# EAGLE design unicorder-mk-2.1 (EAGLE 6.5.0)
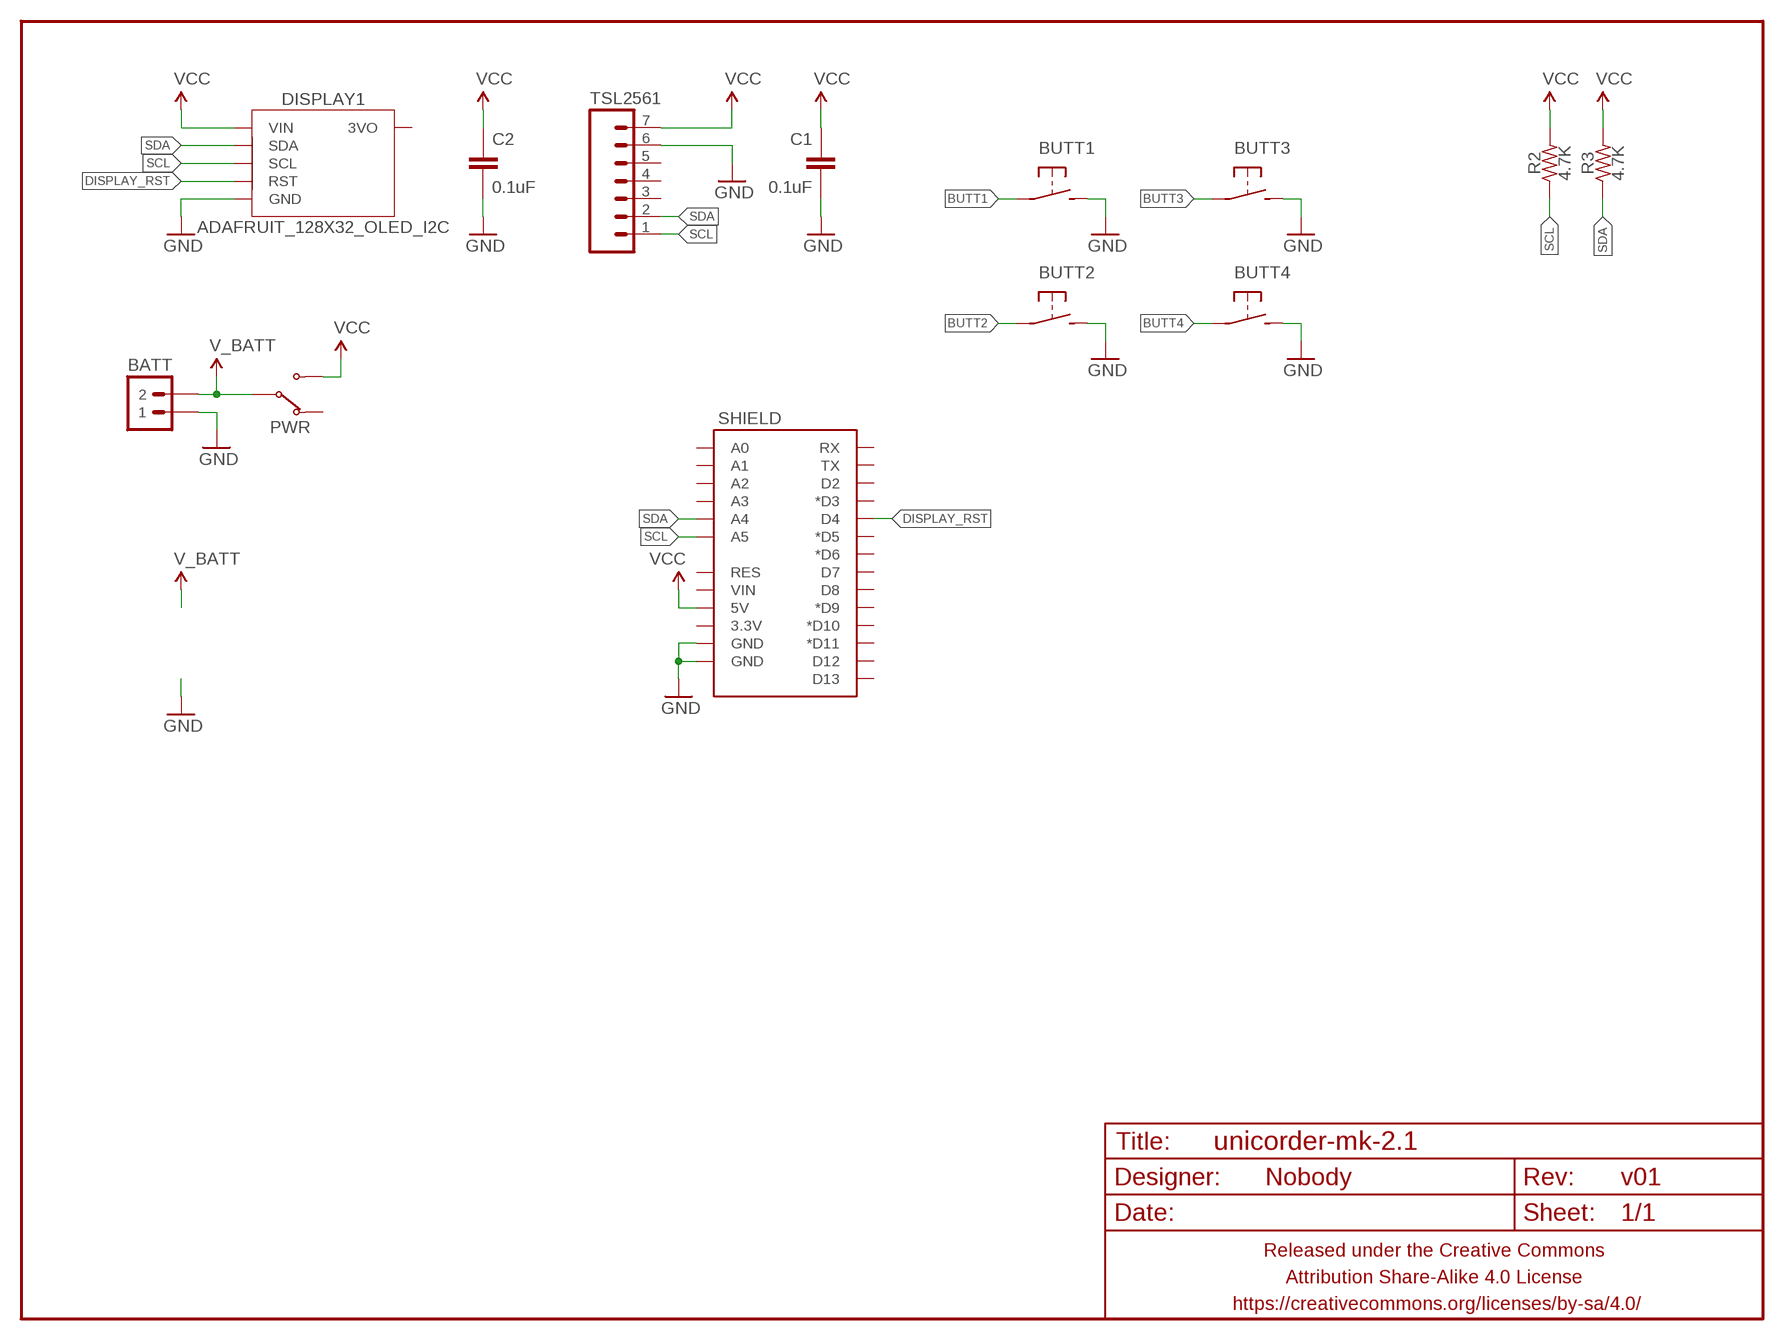
[diagram p0: schematic, sheet 1]

## Parts
BATT  M02JST-PTH-VERT  [JST-2-PH-VERT-PTH]
BUTT1  SPST-NO-TACT6MM-PTH-SMALL-PADS  [DTS-6-SMALL-PADS]
BUTT2  SPST-NO-TACT6MM-PTH-SMALL-PADS  [DTS-6-SMALL-PADS]
BUTT3  SPST-NO-TACT6MM-PTH-SMALL-PADS  [DTS-6-SMALL-PADS]
BUTT4  SPST-NO-TACT6MM-PTH-SMALL-PADS  [DTS-6-SMALL-PADS]
C1  0.1uF  CAPACITOR-CERAMIC025-024X044  [C025-024X044]
C2  0.1uF  CAPACITOR-CERAMIC025-024X044  [C025-024X044]
DISPLAY1  ADAFRUIT_128X32_OLED_I2C  ADAFRUIT_128X32_OLED_I2CCLOSER  [ADAFRUIT_128X32_OLED_I2C_CLOSER]
FRAME1  FRAME-LETTERNO_PACKAGE  [DUMMY]
PWR  SWITCH-SPDTPTH-VERT-2.54MM  [SWITCH-SPDT]
R2  4.7K  RESISTORPTH-AXIAL-6.35MM  [RESISTOR-AXIAL-PTH-6.35MM]
R3  4.7K  RESISTORPTH-AXIAL-6.35MM  [RESISTOR-AXIAL-PTH-6.35MM]
SHIELD  ARDUINO_SHIELD_SMALLER  [ARDUINO_SHIELD_NOOUTLINE_INSIDE_SMALLER]
TSL2561  M07PTH-SLIMASS  [1X07_PTH_SLIMASS]

## Nets
BUTT1: BUTT1.1 BUTT1.2
BUTT2: BUTT2.1 BUTT2.2
BUTT3: BUTT3.1 BUTT3.2
BUTT4: BUTT4.1 BUTT4.2
DISPLAY_RST: DISPLAY1.RST SHIELD.D4
GND: BATT.1 BUTT1.3 BUTT1.4 BUTT2.3 BUTT2.4 BUTT3.3 BUTT3.4 BUTT4.3 BUTT4.4 C1.2 C2.2 DISPLAY1.GND SHIELD.GND@0(GND) SHIELD.GND@1(GND) TSL2561.6
SCL: DISPLAY1.SCL R2.P$1 SHIELD.A5 TSL2561.1
SDA: DISPLAY1.SDA R3.P$1 SHIELD.A4 TSL2561.2
V_BATT: BATT.2 PWR.2(COM)
VCC: C1.1 C2.1 DISPLAY1.VIN PWR.3(NO) R2.P$2 R3.P$2 SHIELD.5V TSL2561.7
Unconnected: DISPLAY1.3VO PWR.1(NC) SHIELD.3.3V SHIELD.A0 SHIELD.A1 SHIELD.A2 SHIELD.A3 SHIELD.D2 SHIELD.D3(*D3) SHIELD.D5(*D5) SHIELD.D6(*D6) SHIELD.D7 SHIELD.D8 SHIELD.D9(*D9) SHIELD.D10(*D10) SHIELD.D11(*D11) SHIELD.D12 SHIELD.D13 SHIELD.RES SHIELD.RX SHIELD.TX SHIELD.VIN TSL2561.3 TSL2561.4 TSL2561.5

## Library data of the parts
BATT = A_butts:M02: Standard 2-pin 0.1" header. Use with - straight break away headers ( PRT-00116) - right angle break away headers (PRT-00553) - swiss pins (PRT-00743) - machine pins (PRT-00117) - female headers (PRT-00115) Molex polarized connector foot print use with: PRT-08233 with associated crimp pins and housings. 2.54_SCREWTERM for use with PRT-10571. 3.5mm Screw Terminal footprints for PRT-08084 5mm Screw Terminal footprints for use with PRT-08433
BUTT1-BUTT4 = A_butts:SPST-NO-TACT
C1 C2 = A_butts:CAPACITOR-CERAMIC: CAPACITOR, European symbol
DISPLAY1 = A_butts:ADAFRUIT_128X32_OLED_I2C
FRAME1 = A_butts:FRAME-LETTER: Schematic Frame Standard 8.5x11 US Letter frame; DESIGNER: Nobody; VERSION: v01
PWR = A_butts:SWITCH-SPDT
R2 R3 = A_butts:RESISTOR: RESISTOR, American symbol
SHIELD = A_butts:ARDUINO_SHIELD_SMALLER
TSL2561 = A_butts:M07: Header 7 Standard 7-pin 0.1" header. Use with straight break away headers (SKU : PRT-00116), right angle break away headers (PRT-00553), swiss pins (PRT-00743), machine pins (PRT-00117), and female headers (PRT-00115). NOTES ON THE VARIANTS LOCK and LOCK_LONGPADS... This footprint was designed to help hold the alignment of a through-hole component (i.e. 7-pin header) while soldering it into place. You may notice that each hole has been shifted either up or down by 0.005 of an inch from it's more standard position (which is usually a perfectly straight line). This slight alteration caused the pins (the squares in the middle) to touch the edges of the holes. Because they are alternating, it causes a "brace" to hold the header in place. 0.005 has proven to be the perfect amount of "off-center" position when using our standard breakaway headers. Although looks a little odd when you look at the bare footprint, once you have a header in there, the alteration is very hard to notice. Also, if you push a header all the way into place, it is covered up entirely on the bottom side. This idea of altering the position of holes to aid alignment will be further integrated into the Sparkfun Library for other footprints. It can help hold any component with 3 or more connection pins.

## Board
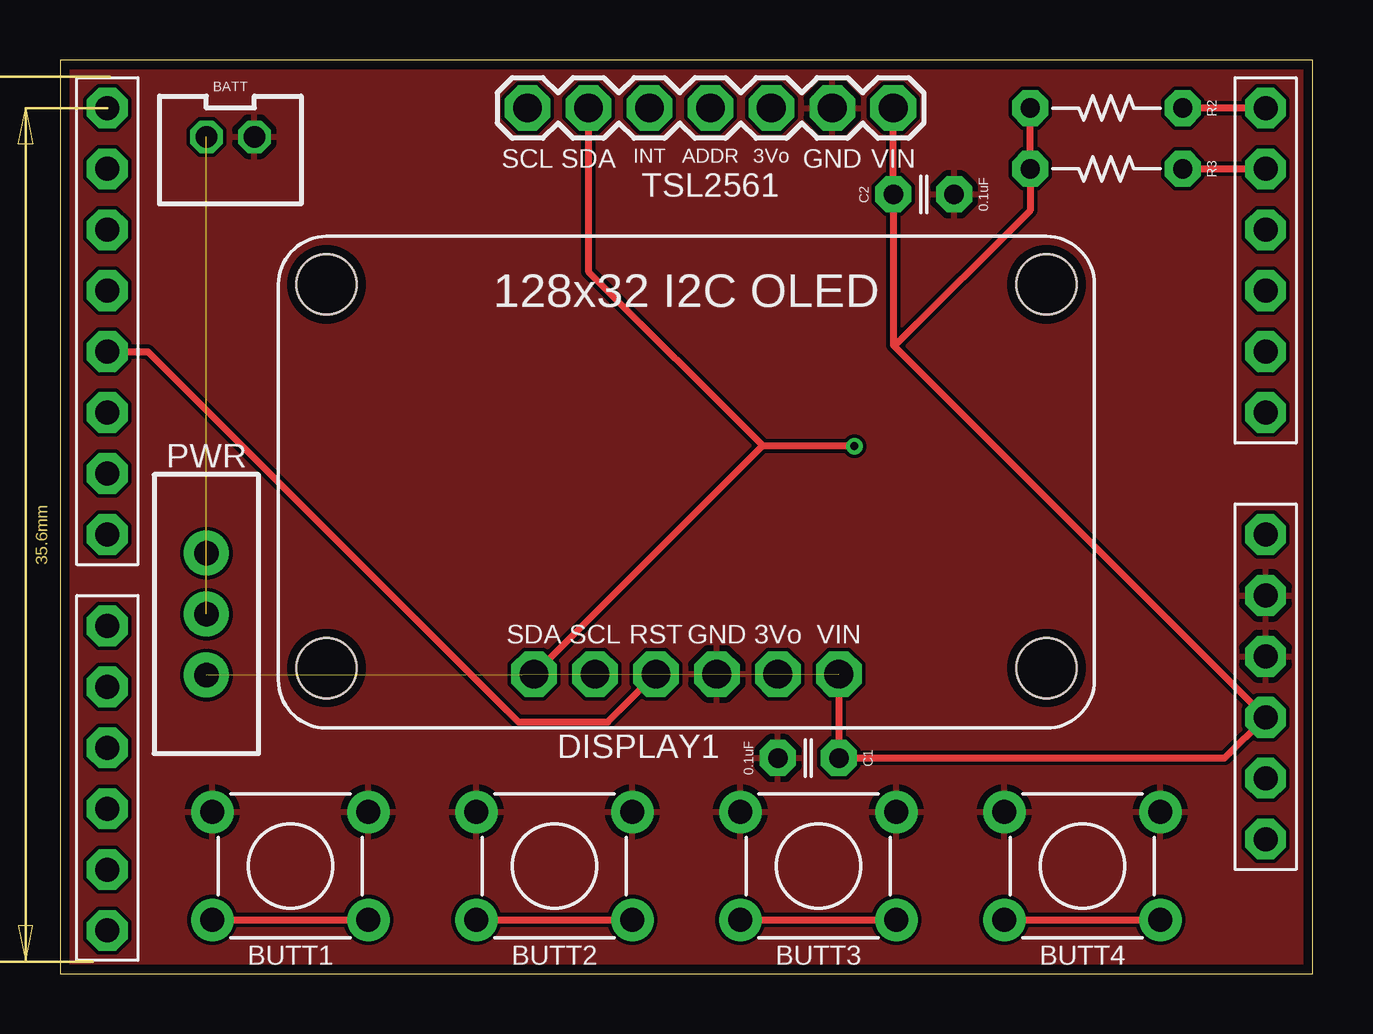
[diagram p1: board, top side]
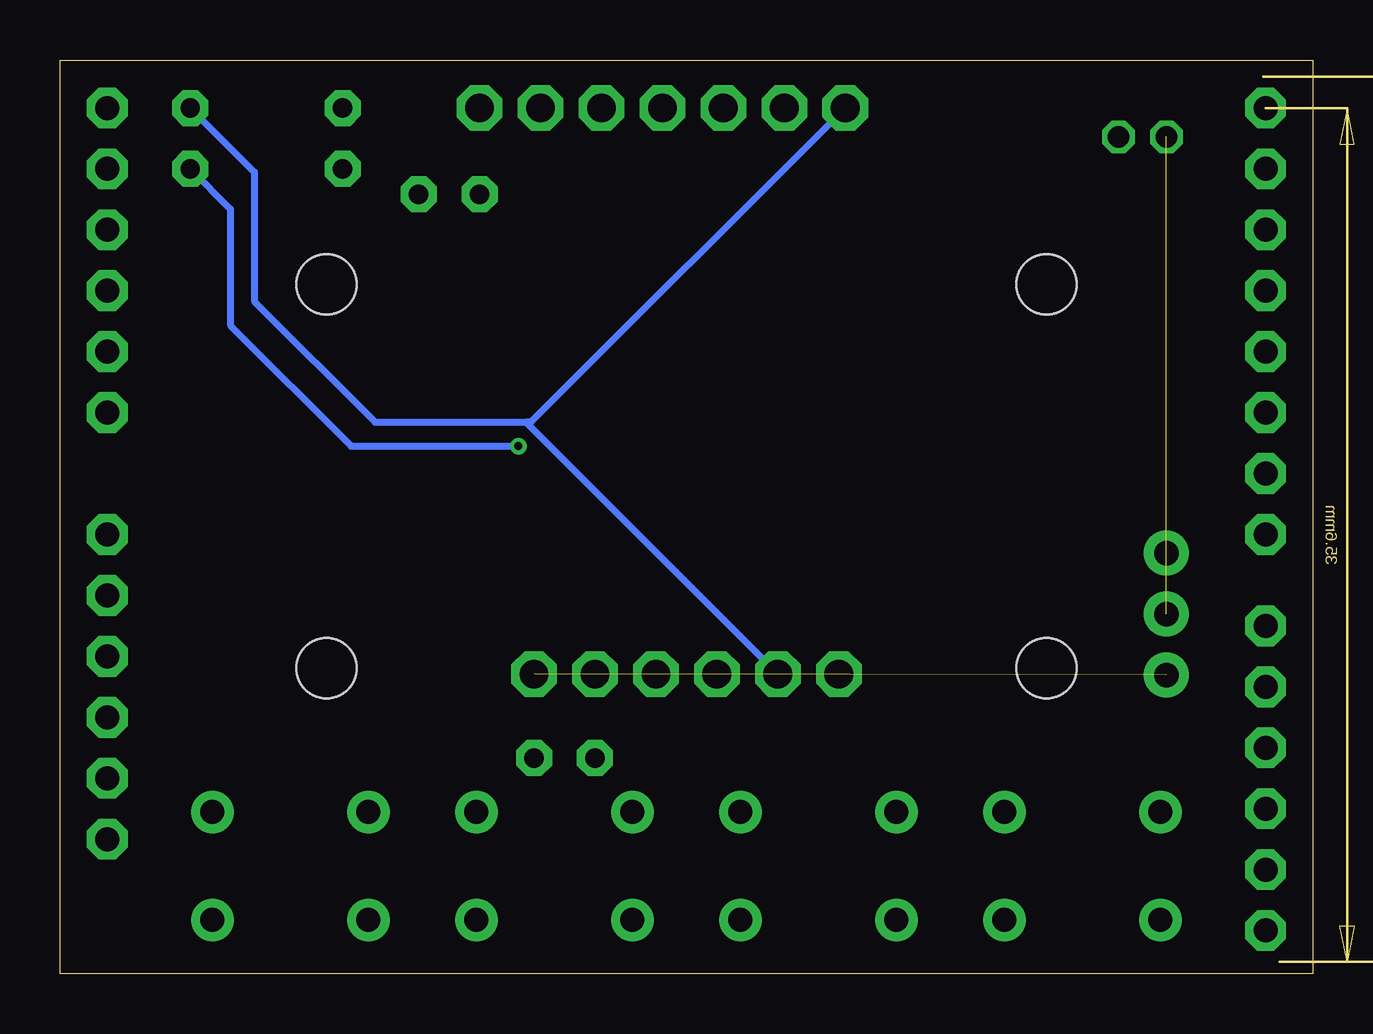
[diagram p2: board, bottom side, seen from below]

Size 52.2 x 38.1 mm. Coordinates in mm from the lower left corner, seen from the top.
Outline: 0,38.1 0,0 52.2,0 52.2,38.1 0,38.1
Copper layers (1*16): Top 0.0356mm / dielectric 1.5011mm / Bottom 0.0356mm
Design rules "LaenPCBOrder_2": minimum track width 6mil, minimum drill 13mil, track to track 6mil, track to pad 6mil, pad to pad 6mil, via to via 6mil, smd to smd 6mil, copper to edge 15mil, drill to drill 6mil, minimum pad ring 7mil, minimum via ring 7mil, stop-mask expansion 3mil, vias tented up to drill 20mil, thermal gap 10mil

### Footprints (pad centres in the part's own frame; a part is rotated, then mirrored left to right if it is on the bottom)
JST-2-PH-VERT-PTH = drill 0.9 octagon: 1 -1,0; 2 1,0
DTS-6-SMALL-PADS = drill 1 pad 1.778: 1 -3.25,2.25; 2 3.25,2.25; 3 -3.25,-2.25; 4 3.25,-2.25
C025-024X044 = drill 0.813 pad 1.5 octagon: 1 -1.27,0; 2 1.27,0
ADAFRUIT_128X32_OLED_I2C_CLOSER = drill 1.2 pad 1.9 octagon: 3VO 3.81,0; GND 1.27,0; RST -1.27,0; SCL -3.81,0; SDA -6.35,0; VIN 6.35,0 | hole 2.5: -15,16.246; 15,16.246; 15,0.254; -15,0.254
SWITCH-SPDT = drill 1.016 pad 1.88: 1 0,2.54; 2 0,0; 3 0,-2.54
RESISTOR-AXIAL-PTH-6.35MM = drill 0.8 pad 1.5 octagon: P$1 -3.175,0; P$2 3.175,0
ARDUINO_SHIELD_NOOUTLINE_INSIDE_SMALLER = drill 1 pad 1.7 octagon: 3.3V 48.26,-27.94; 5V 48.26,-25.4; A0 48.26,-12.7; A1 48.26,-10.16; A2 48.26,-7.62; A3 48.26,-5.08; A4 48.26,-2.54; A5 48.26,0; D2 0,-5.08; D3 0,-7.62; D4 0,-10.16; D5 0,-12.7; D6 0,-15.24; D7 0,-17.78; D8 0,-21.59; D9 0,-24.13; D10 0,-26.67; D11 0,-29.21; D12 0,-31.75; D13 0,-34.29; GND@0 48.26,-22.86; GND@1 48.26,-20.32; RES 48.26,-30.48; RX 0,0; TX 0,-2.54; VIN 48.26,-17.78
1X07_PTH_SLIMASS = drill 1.2 pad 1.9 octagon: 1 0,0; 2 2.54,0; 3 5.08,0; 4 7.62,0; 5 10.16,0; 6 12.7,0; 7 15.24,0

### Placement (x,y rotation side)
BATT  7.1,34.9 180 top
BUTT1  9.6,4.5 180 top
BUTT2  20.6,4.5 180 top
BUTT3  31.6,4.5 180 top
BUTT4  42.6,4.5 180 top
C1  31.18,9 180 top
C2  35.99,32.5 0 top
DISPLAY1  26.1,12.5 0 top
FRAME1  0,0 0 top
PWR  6.1,15 0 top
R2  43.6,36.1 180 top
R3  43.6,33.56 180 top
SHIELD  1.97,36.1 0 top
TSL2561  19.48,36.1 0 top

### Tracks (layer width: path | path; a pad name or v marks a point on that pad's centre or on a via)
BUTT1
  Top 0.3: BUTT1.2 BUTT1.1
BUTT2
  Top 0.3: BUTT2.2 BUTT2.1
BUTT3
  Top 0.3: BUTT3.2 BUTT3.1
BUTT4
  Top 0.3: BUTT4.2 BUTT4.1
DISPLAY_RST
  Top 0.3: SHIELD.D4 3.66,25.94 19.1,10.5 22.83,10.5 DISPLAY1.RST
GND
  pour Top: 0,0 0,38.2 52.3,38.2 52.3,0
SCL
  Top 0.3: SHIELD.A5 R2.P$1
  Bottom 0.3: R2.P$1 44.1,33.42 44.1,28.03 39.07,23 32.79,23 | DISPLAY1.SCL 32.79,23 | TSL2561.1 32.58,23 32.79,23
SDA  (via drill 0.33)
  Top 0.3: R3.P$1 SHIELD.A4 | v33.1,22 29.3,22 | 29.3,22 29.25,22 DISPLAY1.SDA | TSL2561.2 22.02,29.28 29.3,22
  Bottom 0.3: R3.P$1 45.1,31.89 45.1,27.03 40.07,22 v33.1,22
V_BATT  (1 unrouted)
VCC  (1 unrouted)
  Top 0.3: DISPLAY1.VIN C1.1 48.53,9 SHIELD.5V 34.77,26.16 | 34.77,26.16 34.72,26.21 C2.1 TSL2561.7 | 34.77,26.16 40.43,31.82 R3.P$2 R2.P$2

### Text on the board
tPlace: SCL | SDA | INT | ADDR | 3Vo | GND | VIN